# Altium schematic sheet Interface.SchDoc
size A4
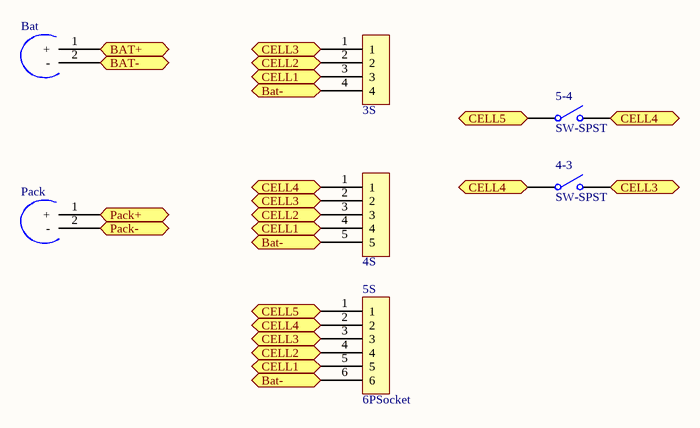
[diagram p0: Interface.SchDoc]

## Parts
3S  4PSocket  [4PSocket-s]  (value not drawn)
4-3  SW-SPST  [SolderBridge60mil - 2]
4S  5PSocket  [5PSocket]  (value not drawn)
5-4  SW-SPST  [SolderBridge60mil - 2]
5S  6PSocket  [6PSocket]
Bat  Battery_AWG12  [Battery_AWG12]  (value not drawn)
Pack  Battery_AWG12  [Battery_AWG12]  (value not drawn)

## Ports
BAT+, BAT-, Bat-, CELL1, CELL2, CELL3, CELL4, CELL5, Pack+, Pack-

## Nets
BAT+: Bat.1(+) ; port BAT+
BAT-: 3S.4 4S.5 5S.6 Bat.2(-) ; port BAT-, port Bat-
CELL1: 3S.3 4S.4 5S.5 ; port CELL1
CELL2: 3S.2 4S.3 5S.4 ; port CELL2
CELL3: 3S.1 4-3.2(NO) 4S.2 5S.3 ; port CELL3
CELL4: 4-3.1(COMMON) 4S.1 5-4.2(NO) 5S.2 ; port CELL4
CELL5: 5-4.1(COMMON) 5S.1 ; port CELL5
Pack+: Pack.1(+) ; port Pack+
Pack-: Pack.2(-) ; port Pack-

## Library data of the parts
4-3 5-4 = SW-SPST: Single-Pole, Single-Throw Switch; Published: 24-Mar-1999; LatestRevisionDate: 17-Jul-2002; LatestRevisionNote: Re-released for DXP Platform.; PackageReference: SPST-2; Publisher: Altium Limited; PackageDescription: Switch; 2 Leads